# Altium project BLE LED controller.PrjPCB
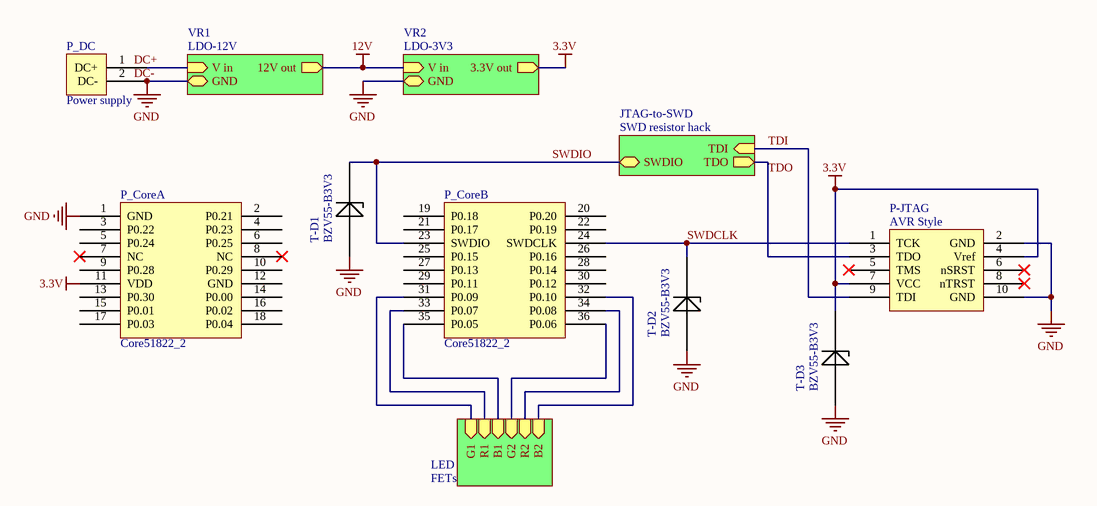
[diagram p0: Top.SchDoc]
4 sheets, 16 parts. Net scope: hierarchical (ports join the sheet entries above them; power ports are global).
Board file: Controller.PcbDoc
Sheets:
  Top.SchDoc
    VR2 = LDO-3V3.SchDoc
    LED = FETs.SchDoc
    JTAG-to-SWD = SWD resistor hack.SchDoc

## Sheet Top.SchDoc
size A4

### Parts
P-JTAG  AVR Style  [Header 2x5 IDC-10S]
P_Core  Core51822_2  [Core51822]  (parts A,B of 2)
P_DC  Power supply  [DC cable pad with holes]
T-D1  BZV55-B3V3  [Minimelf]
T-D2  BZV55-B3V3  [Minimelf]
T-D3  BZV55-B3V3  [Minimelf]

### Sub-sheets
JTAG-to-SWD = SWD resistor hack: SWDIO (bidir), TDO (out), TDI (in)
LED = FETs: G1 (in), R1 (in), B1 (in), B2 (in), G2 (in), R2 (in)
VR1 = LDO-12V (file not in this document): 12V out (out), GND, V in (in)
VR2 = LDO-3V3: 3.3V out (out), GND, V in (in)

### Nets
3.3V: P-JTAG.4(Vref) P-JTAG.7(VCC) P_Core.11(VDD) T-D3.1 ; sheet VR2/3.3V out
12V: sheet VR2/V in, sheet VR1/12V out
GND: P-JTAG.2(GND) P-JTAG.10(GND) P_Core.1(GND) P_DC.2(DC-) T-D1.2 T-D2.2 T-D3.2 ; sheet VR2/GND, sheet VR1/GND
SWDCLK: P-JTAG.1(TCK) P_Core.24(SWDCLK) T-D2.1
SWDIO: P_Core.23(SWDIO) T-D1.1 ; sheet JTAG-to-SWD/SWDIO
TDI: P-JTAG.9(TDI) ; sheet JTAG-to-SWD/TDI
TDO: P-JTAG.3(TDO) ; sheet JTAG-to-SWD/TDO
NetIRF1_2: P_Core.31(P0.09) ; sheet LED/G1
NetIRF1_4: P_Core.33(P0.07) ; sheet LED/R1
NetIRF2_2: P_Core.35(P0.05) ; sheet LED/B1
NetIRF2_4: P_Core.36(P0.06) ; sheet LED/G2
NetIRF3_2: P_Core.34(P0.08) ; sheet LED/R2
NetIRF3_4: P_Core.32(P0.10) ; sheet LED/B2
NetP_DC_1: P_DC.1(DC+) ; sheet VR1/V in

Not connected (* = marked no-connect by the designer): P-JTAG 5(TMS)* 6(nSRST)* 8(nTRST)*; P_Core 2(P0.21) 3(P0.22) 4(P0.23) 5(P0.24) 6(P0.25) 7(NC)* 8(NC)* 9(P0.28) 10(P0.29) 12(GND) 13(P0.30) 14(P0.00) 15(P0.01) 16(P0.02) 17(P0.03) 18(P0.04) 19(P0.18) 20(P0.20) 21(P0.17) 22(P0.19) 25(P0.15) 26(P0.16) 27(P0.13) 28(P0.14) 29(P0.11) 30(P0.12)

### Notes on the sheet
- Labels drawn without touching a wire or pin: DC+, DC-

### Library data of the parts
P-JTAG = Header JTAG AVR
T-D1-T-D3 = Zener Diode

## Sheet LDO-3V3.SchDoc
size A4
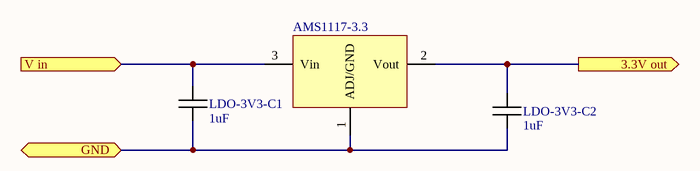
[diagram p1: LDO-3V3.SchDoc]

### Parts
AMS1117-3.3  AMS1117  [SOT-223-3]  (value not drawn)
LDO-3V3-C1  1uF  [C 0805 / 2012]
LDO-3V3-C2  1uF  [C 0805 / 2012]

### Ports
3.3V out (out), GND, V in (in)

### Nets
3.3V: AMS1117-3.3.2(Vout) LDO-3V3-C2.2 ; port 3.3V out
12V: AMS1117-3.3.3(Vin) LDO-3V3-C1.2 ; port V in
GND: AMS1117-3.3.1(ADJ/GND) LDO-3V3-C1.1 LDO-3V3-C2.1 ; port GND

### Library data of the parts
AMS1117-3.3 = AMS1117: LDO 3.3V/5V/12V
LDO-3V3-C1 LDO-3V3-C2 = Capacitor

## Sheet FETs.SchDoc
size A4
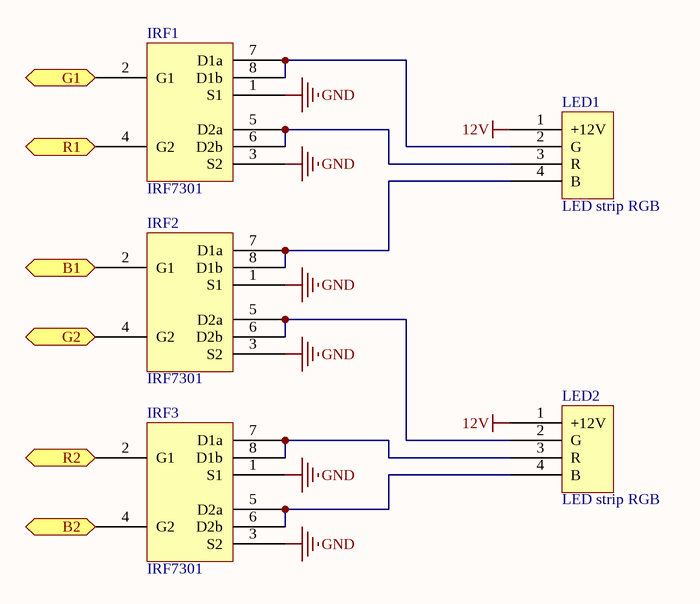
[diagram p2: FETs.SchDoc]

### Parts
IRF1  IRF7301  [SOIC-8]
IRF2  IRF7301  [SOIC-8]
IRF3  IRF7301  [SOIC-8]
LED1  LED strip RGB  [LED strip RGB connector]
LED2  LED strip RGB  [LED strip RGB connector]

### Ports
B1 (in), B2 (in), G1 (in), G2 (in), R1 (in), R2 (in)

### Nets
12V: LED1.1(+12V) LED2.1(+12V)
GND: IRF1.1(S1) IRF1.3(S2) IRF2.1(S1) IRF2.3(S2) IRF3.1(S1) IRF3.3(S2)
NetIRF1_2: IRF1.2(G1) ; port G1
NetIRF1_4: IRF1.4(G2) ; port R1
NetIRF1_5: IRF1.5(D2a) IRF1.6(D2b) LED1.3(R)
NetIRF1_7: IRF1.7(D1a) IRF1.8(D1b) LED1.2(G)
NetIRF2_2: IRF2.2(G1) ; port B1
NetIRF2_4: IRF2.4(G2) ; port G2
NetIRF2_5: IRF2.5(D2a) IRF2.6(D2b) LED2.2(G)
NetIRF2_7: IRF2.7(D1a) IRF2.8(D1b) LED1.4(B)
NetIRF3_2: IRF3.2(G1) ; port R2
NetIRF3_4: IRF3.4(G2) ; port B2
NetIRF3_5: IRF3.5(D2a) IRF3.6(D2b) LED2.4(B)
NetIRF3_7: IRF3.7(D1a) IRF3.8(D1b) LED2.3(R)

## Sheet SWD resistor hack.SchDoc
size A4
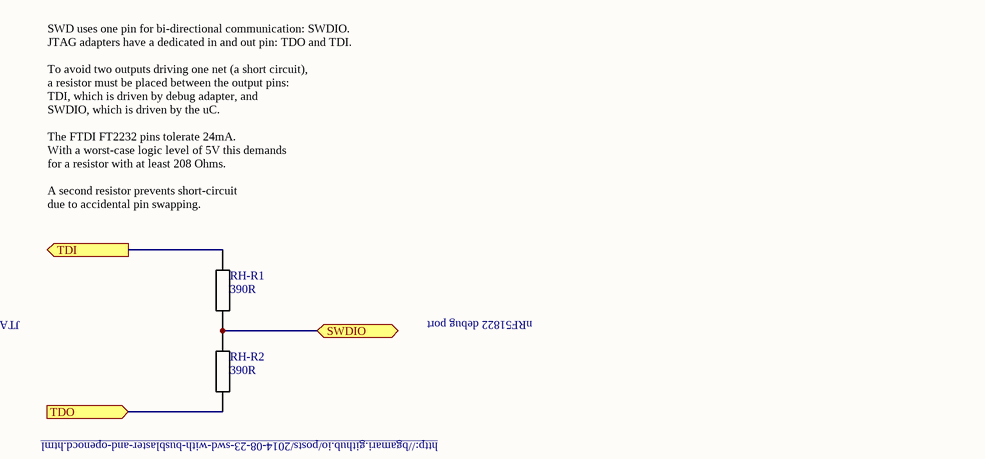
[diagram p3: SWD resistor hack.SchDoc]

### Parts
RH-R1  390R  [R 0805 / 2012 wide]
RH-R2  390R  [R 0805 / 2012 wide]

### Ports
SWDIO, TDI (out), TDO (in)

### Nets
SWDIO: RH-R1.1 RH-R2.2 ; port SWDIO
TDI: RH-R1.2 ; port TDI
TDO: RH-R2.1 ; port TDO

### Notes on the sheet
- (near RH-R1) SWD uses one pin for bi-directional communication: SWDIO.
  JTAG adapters have a dedicated in and out pin: TDO and TDI.
  To avoid two outputs driving one net (a short circuit),
  a resistor must be placed between the output pins:
  TDI, which is driven by debug adapter, and
  SWDIO, which is driven by the uC.
  The FTDI FT2232 pins tolerate 24mA.
  With a worst-case logic level of 5V this demands
  for a resistor with at least 208 Ohms.
  A second resistor prevents short-circuit
  due to accidental pin swapping.
- JTAG/SWD debug adapter
- nRF51822 debug port
- (near RH-R2) http://bgamari.github.io/posts/2014-08-23-swd-with-busblaster-and-openocd.html

### Library data of the parts
RH-R1 RH-R2 = Resistor

## Nets that join several sheets
3.3V: Top (P-JTAG.4 P-JTAG.7 P_Core.11 T-D3.1), LDO-3V3 (AMS1117-3.3.2 LDO-3V3-C2.2)
12V: LDO-3V3 (AMS1117-3.3.3 LDO-3V3-C1.2), FETs (LED1.1 LED2.1)
GND: Top (7 pins), LDO-3V3 (AMS1117-3.3.1 LDO-3V3-C1.1 LDO-3V3-C2.1), FETs (6 pins)
NetIRF1_2: Top (P_Core.31), FETs (IRF1.2)
NetIRF1_4: Top (P_Core.33), FETs (IRF1.4)
NetIRF2_2: Top (P_Core.35), FETs (IRF2.2)
NetIRF2_4: Top (P_Core.36), FETs (IRF2.4)
NetIRF3_2: Top (P_Core.34), FETs (IRF3.2)
NetIRF3_4: Top (P_Core.32), FETs (IRF3.4)
SWDIO: Top (P_Core.23 T-D1.1), SWD resistor hack (RH-R1.1 RH-R2.2)
TDI: Top (P-JTAG.9), SWD resistor hack (RH-R1.2)
TDO: Top (P-JTAG.3), SWD resistor hack (RH-R2.1)